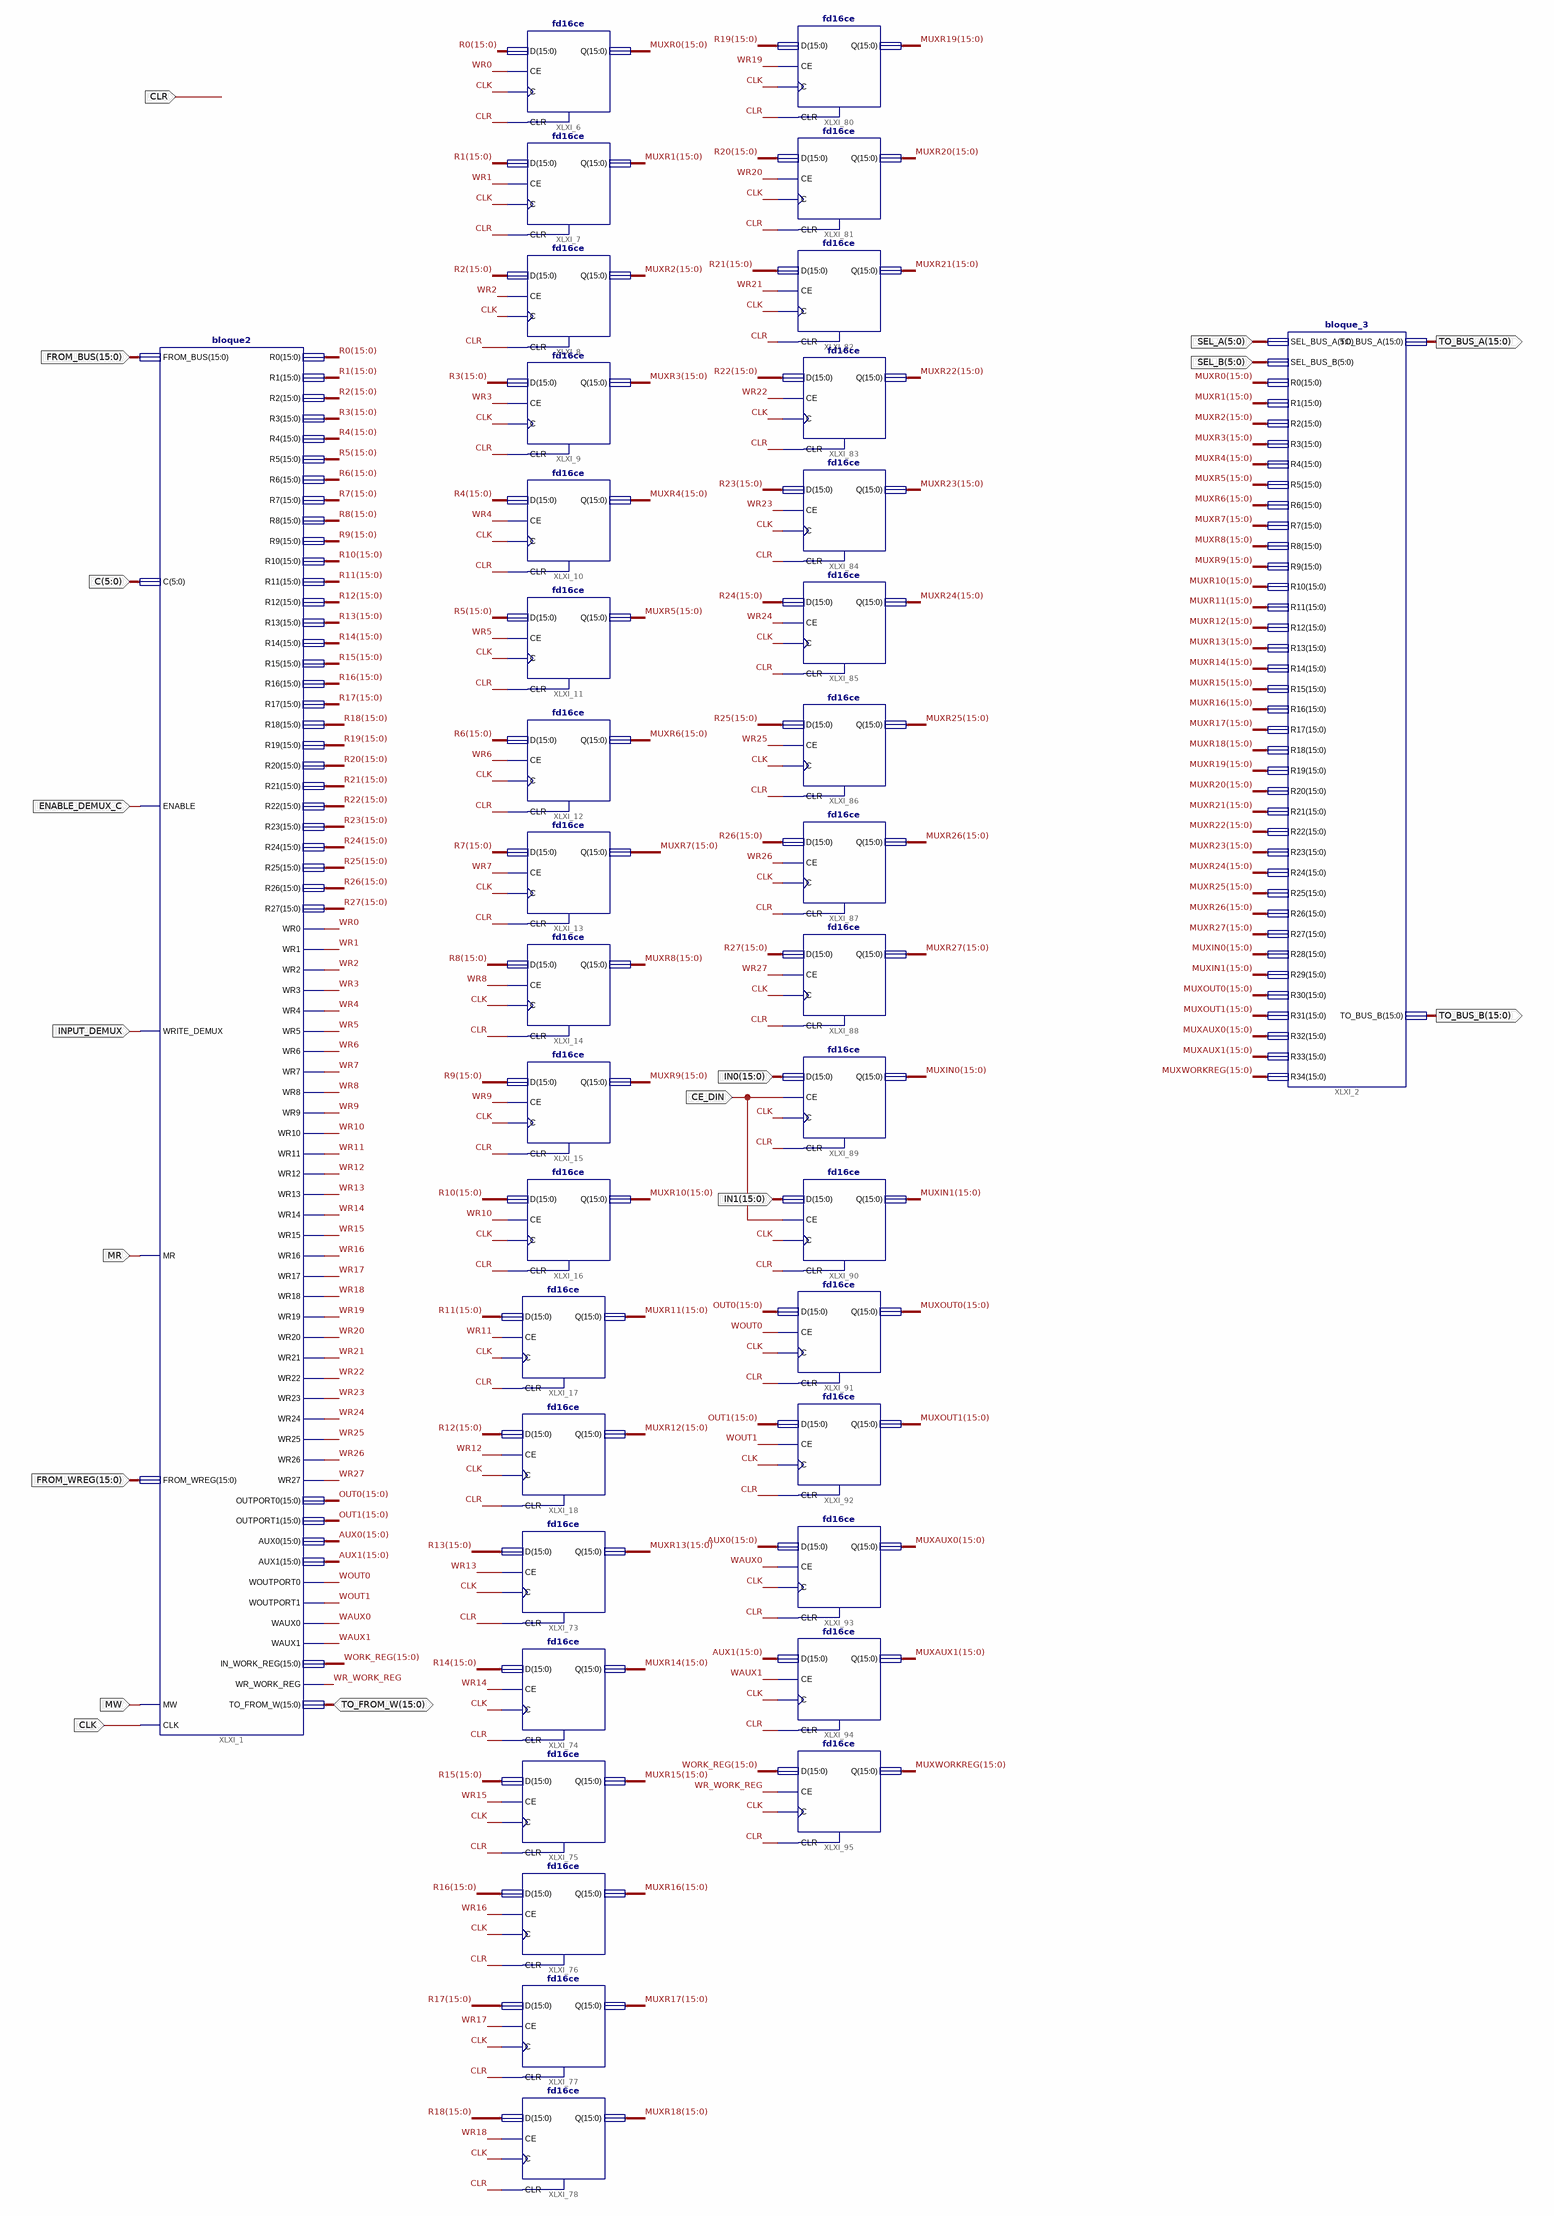
[diagram p0: schematic sheet 1]
// Xilinx ISE schematic register_bank.sch (artix7) as structural Verilog: 37 symbols, 17 ports
module register_bank (
  input  CLR,
  input  [5:0] SEL_A,
  input  [5:0] SEL_B,
  input  CLK,
  input  [15:0] IN0,
  input  [15:0] IN1,
  input  CE_DIN,
  input  [15:0] FROM_BUS,
  input  [5:0] C,
  input  ENABLE_DEMUX_C,
  input  INPUT_DEMUX,
  input  MR,
  input  [15:0] FROM_WREG,
  input  MW,
  inout  [15:0] TO_FROM_W,
  output [15:0] TO_BUS_A,
  output [15:0] TO_BUS_B
);

  wire WAUX0, WAUX1, WOUT0, WOUT1, WR0, WR1, WR2, WR3, WR4, WR5, WR6, WR7, WR8, WR9, WR10, WR11, WR12, WR13,
       WR14, WR15, WR16, WR17, WR18, WR19, WR20, WR21, WR22, WR23, WR24, WR25, WR26, WR27, WR_WORK_REG;
  wire [15:0] AUX0, AUX1, MUXAUX0, MUXAUX1, MUXIN0, MUXIN1, MUXOUT0, MUXOUT1, MUXR0, MUXR1, MUXR2, MUXR3,
       MUXR4, MUXR5, MUXR6, MUXR7, MUXR8, MUXR9, MUXR10, MUXR11, MUXR12, MUXR13, MUXR14, MUXR15, MUXR16,
       MUXR17, MUXR18, MUXR19, MUXR20, MUXR21, MUXR22, MUXR23, MUXR24, MUXR25, MUXR26, MUXR27, MUXWORKREG,
       OUT0, OUT1, R0, R1, R2, R3, R4, R5, R6, R7, R8, R9, R10, R11, R12, R13, R14, R15, R16, R17, R18, R19,
       R20, R21, R22, R23, R24, R25, R26, R27, WORK_REG;

  bloque_3 XLXI_2 (
    .SEL_BUS_A(SEL_A), .SEL_BUS_B(SEL_B), .R0(MUXR0), .R1(MUXR1), .R2(MUXR2), .R3(MUXR3), .R4(MUXR4),
    .R5(MUXR5), .R6(MUXR6), .R7(MUXR7), .R8(MUXR8), .R9(MUXR9), .R10(MUXR10), .R11(MUXR11), .R12(MUXR12),
    .R13(MUXR13), .R14(MUXR14), .R15(MUXR15), .R16(MUXR16), .R17(MUXR17), .R18(MUXR18), .R19(MUXR19),
    .R20(MUXR20), .R21(MUXR21), .R22(MUXR22), .R23(MUXR23), .R24(MUXR24), .R25(MUXR25), .R26(MUXR26),
    .R27(MUXR27), .R28(MUXIN0), .R29(MUXIN1), .R30(MUXOUT0), .R31(MUXOUT1), .TO_BUS_A(TO_BUS_A),
    .TO_BUS_B(TO_BUS_B), .R32(MUXAUX0), .R33(MUXAUX1), .R34(MUXWORKREG));
  fd16ce XLXI_18 (.C(CLK), .CE(WR12), .CLR(CLR), .D(R12), .Q(MUXR12));
  fd16ce XLXI_17 (.C(CLK), .CE(WR11), .CLR(CLR), .D(R11), .Q(MUXR11));
  fd16ce XLXI_16 (.C(CLK), .CE(WR10), .CLR(CLR), .D(R10), .Q(MUXR10));
  fd16ce XLXI_15 (.C(CLK), .CE(WR9), .CLR(CLR), .D(R9), .Q(MUXR9));
  fd16ce XLXI_14 (.C(CLK), .CE(WR8), .CLR(CLR), .D(R8), .Q(MUXR8));
  fd16ce XLXI_13 (.C(CLK), .CE(WR7), .CLR(CLR), .D(R7), .Q(MUXR7));
  fd16ce XLXI_12 (.C(CLK), .CE(WR6), .CLR(CLR), .D(R6), .Q(MUXR6));
  fd16ce XLXI_9 (.C(CLK), .CE(WR3), .CLR(CLR), .D(R3), .Q(MUXR3));
  fd16ce XLXI_11 (.C(CLK), .CE(WR5), .CLR(CLR), .D(R5), .Q(MUXR5));
  fd16ce XLXI_10 (.C(CLK), .CE(WR4), .CLR(CLR), .D(R4), .Q(MUXR4));
  fd16ce XLXI_7 (.C(CLK), .CE(WR1), .CLR(CLR), .D(R1), .Q(MUXR1));
  fd16ce XLXI_8 (.C(CLK), .CE(WR2), .CLR(CLR), .D(R2), .Q(MUXR2));
  fd16ce XLXI_6 (.C(CLK), .CE(WR0), .CLR(CLR), .D(R0), .Q(MUXR0));
  fd16ce XLXI_73 (.C(CLK), .CE(WR13), .CLR(CLR), .D(R13), .Q(MUXR13));
  fd16ce XLXI_74 (.C(CLK), .CE(WR14), .CLR(CLR), .D(R14), .Q(MUXR14));
  fd16ce XLXI_75 (.C(CLK), .CE(WR15), .CLR(CLR), .D(R15), .Q(MUXR15));
  fd16ce XLXI_76 (.C(CLK), .CE(WR16), .CLR(CLR), .D(R16), .Q(MUXR16));
  fd16ce XLXI_77 (.C(CLK), .CE(WR17), .CLR(CLR), .D(R17), .Q(MUXR17));
  fd16ce XLXI_78 (.C(CLK), .CE(WR18), .CLR(CLR), .D(R18), .Q(MUXR18));
  fd16ce XLXI_80 (.C(CLK), .CE(WR19), .CLR(CLR), .D(R19), .Q(MUXR19));
  fd16ce XLXI_81 (.C(CLK), .CE(WR20), .CLR(CLR), .D(R20), .Q(MUXR20));
  fd16ce XLXI_82 (.C(CLK), .CE(WR21), .CLR(CLR), .D(R21), .Q(MUXR21));
  fd16ce XLXI_83 (.C(CLK), .CE(WR22), .CLR(CLR), .D(R22), .Q(MUXR22));
  fd16ce XLXI_84 (.C(CLK), .CE(WR23), .CLR(CLR), .D(R23), .Q(MUXR23));
  fd16ce XLXI_85 (.C(CLK), .CE(WR24), .CLR(CLR), .D(R24), .Q(MUXR24));
  fd16ce XLXI_86 (.C(CLK), .CE(WR25), .CLR(CLR), .D(R25), .Q(MUXR25));
  fd16ce XLXI_87 (.C(CLK), .CE(WR26), .CLR(CLR), .D(R26), .Q(MUXR26));
  fd16ce XLXI_88 (.C(CLK), .CE(WR27), .CLR(CLR), .D(R27), .Q(MUXR27));
  fd16ce XLXI_89 (.C(CLK), .CE(CE_DIN), .CLR(CLR), .D(IN0), .Q(MUXIN0));
  fd16ce XLXI_90 (.C(CLK), .CE(CE_DIN), .CLR(CLR), .D(IN1), .Q(MUXIN1));
  fd16ce XLXI_91 (.C(CLK), .CE(WOUT0), .CLR(CLR), .D(OUT0), .Q(MUXOUT0));
  fd16ce XLXI_92 (.C(CLK), .CE(WOUT1), .CLR(CLR), .D(OUT1), .Q(MUXOUT1));
  fd16ce XLXI_93 (.C(CLK), .CE(WAUX0), .CLR(CLR), .D(AUX0), .Q(MUXAUX0));
  fd16ce XLXI_94 (.C(CLK), .CE(WAUX1), .CLR(CLR), .D(AUX1), .Q(MUXAUX1));
  fd16ce XLXI_95 (.C(CLK), .CE(WR_WORK_REG), .CLR(CLR), .D(WORK_REG), .Q(MUXWORKREG));
  bloque2 XLXI_1 (
    .FROM_BUS(FROM_BUS), .C(C), .ENABLE(ENABLE_DEMUX_C), .WRITE_DEMUX(INPUT_DEMUX), .MR(MR),
    .FROM_WREG(FROM_WREG), .MW(MW), .CLK(CLK), .TO_FROM_W(TO_FROM_W), .R0(R0), .R1(R1), .R2(R2), .R3(R3),
    .R4(R4), .R5(R5), .R6(R6), .R7(R7), .R8(R8), .R9(R9), .R10(R10), .R11(R11), .R12(R12), .R13(R13),
    .R14(R14), .R15(R15), .R16(R16), .R17(R17), .R18(R18), .R19(R19), .R20(R20), .R21(R21), .R22(R22),
    .R23(R23), .R24(R24), .R25(R25), .R26(R26), .R27(R27), .WR0(WR0), .WR1(WR1), .WR2(WR2), .WR3(WR3),
    .WR4(WR4), .WR5(WR5), .WR6(WR6), .WR7(WR7), .WR8(WR8), .WR9(WR9), .WR10(WR10), .WR11(WR11), .WR12(WR12),
    .WR13(WR13), .WR14(WR14), .WR15(WR15), .WR16(WR16), .WR17(WR17), .WR18(WR18), .WR19(WR19), .WR20(WR20),
    .WR21(WR21), .WR22(WR22), .WR23(WR23), .WR24(WR24), .WR25(WR25), .WR26(WR26), .WR27(WR27),
    .OUTPORT0(OUT0), .OUTPORT1(OUT1), .AUX0(AUX0), .AUX1(AUX1), .WOUTPORT0(WOUT0), .WOUTPORT1(WOUT1),
    .WAUX0(WAUX0), .WAUX1(WAUX1), .IN_WORK_REG(WORK_REG), .WR_WORK_REG(WR_WORK_REG));
endmodule
